# EAGLE design LED STRIP (EAGLE 6.0)
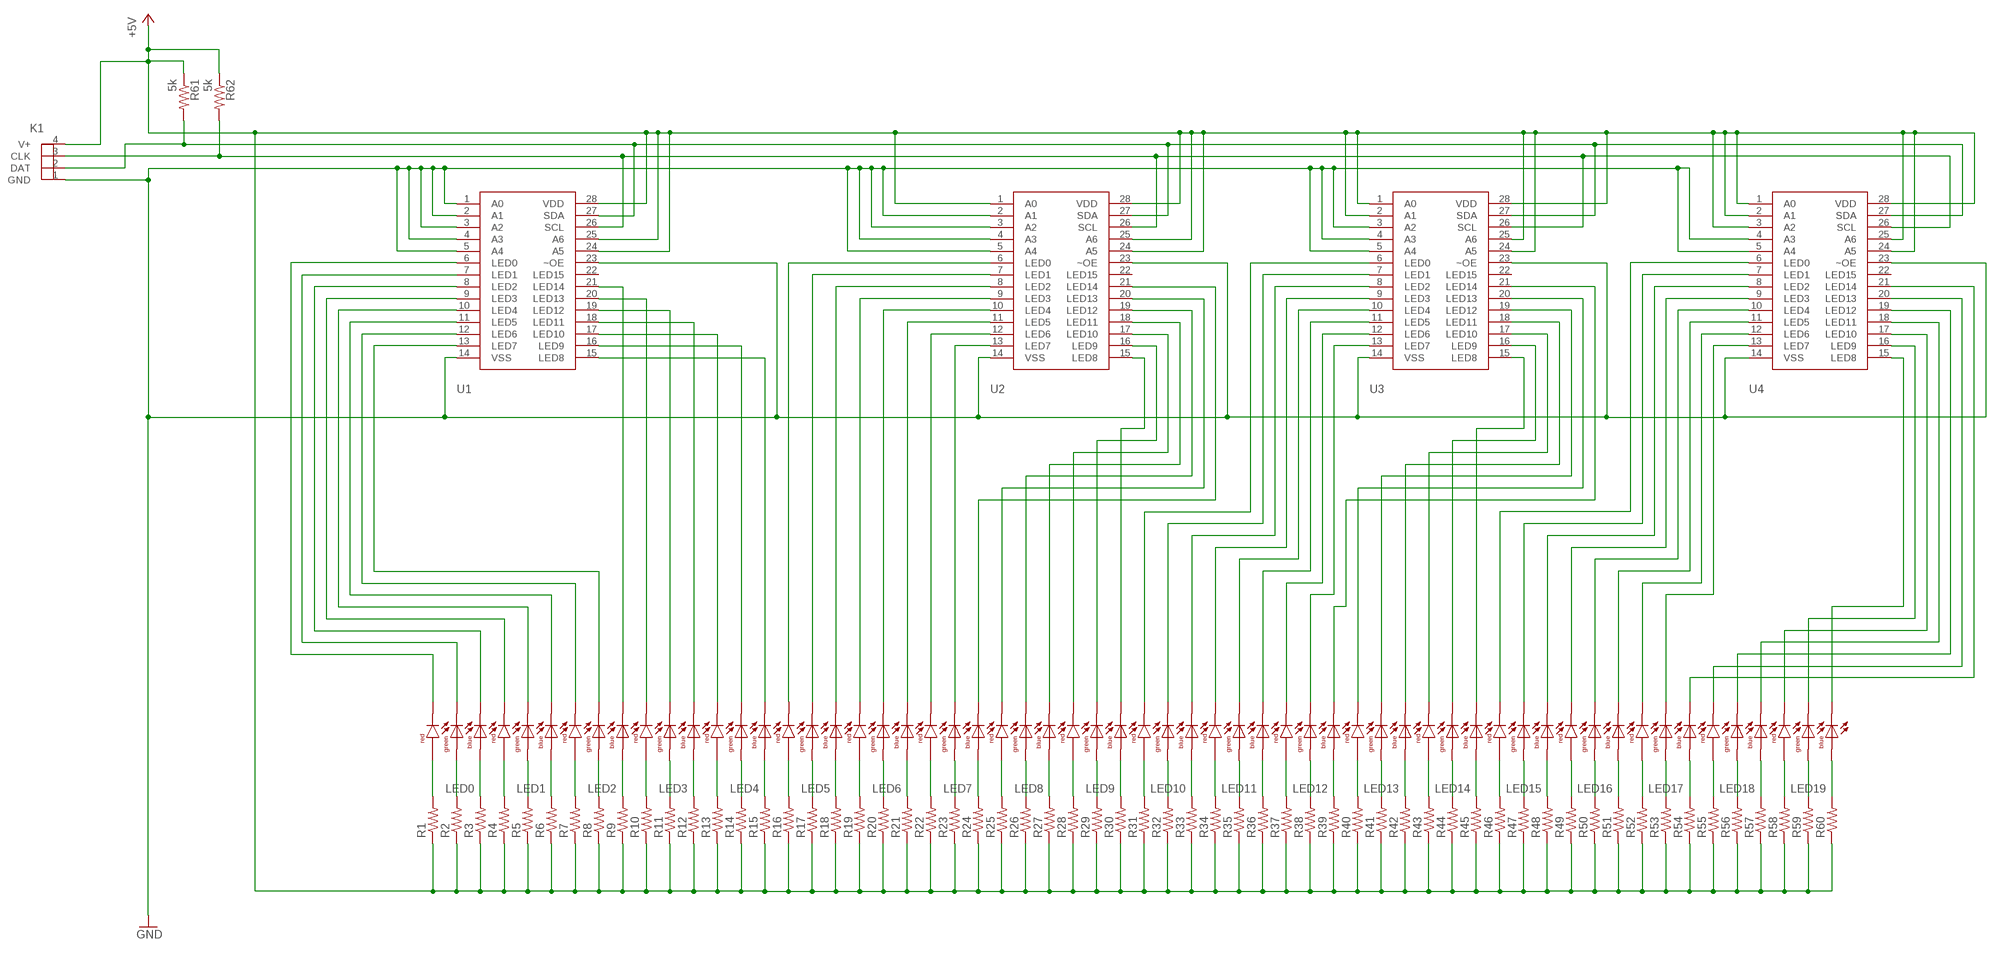
[diagram p0: schematic, sheet 1]

## Parts
K1  LEDCONN  [4CONN]
LED0  LED_RGB  [6-PLCC]
LED1  LED_RGB  [6-PLCC]
LED2  LED_RGB  [6-PLCC]
LED3  LED_RGB  [6-PLCC]
LED4  LED_RGB  [6-PLCC]
LED5  LED_RGB  [6-PLCC]
LED6  LED_RGB  [6-PLCC]
LED7  LED_RGB  [6-PLCC]
LED8  LED_RGB  [6-PLCC]
LED9  LED_RGB  [6-PLCC]
LED10  LED_RGB  [6-PLCC]
LED11  LED_RGB  [6-PLCC]
LED12  LED_RGB  [6-PLCC]
LED13  LED_RGB  [6-PLCC]
LED14  LED_RGB  [6-PLCC]
LED15  LED_RGB  [6-PLCC]
LED16  LED_RGB  [6-PLCC]
LED17  LED_RGB  [6-PLCC]
LED18  LED_RGB  [6-PLCC]
LED19  LED_RGB  [6-PLCC]
R1  R0402  [0402]
R2  R0402  [0402]
R3  R0402  [0402]
R4  R0402  [0402]
R5  R0402  [0402]
R6  R0402  [0402]
R7  R0402  [0402]
R8  R0402  [0402]
R9  R0402  [0402]
R10  R0402  [0402]
R11  R0402  [0402]
R12  R0402  [0402]
R13  R0402  [0402]
R14  R0402  [0402]
R15  R0402  [0402]
R16  R0402  [0402]
R17  R0402  [0402]
R18  R0402  [0402]
R19  R0402  [0402]
R20  R0402  [0402]
R21  R0402  [0402]
R22  R0402  [0402]
R23  R0402  [0402]
R24  R0402  [0402]
R25  R0402  [0402]
R26  R0402  [0402]
R27  R0402  [0402]
R28  R0402  [0402]
R29  R0402  [0402]
R30  R0402  [0402]
R31  R0402  [0402]
R32  R0402  [0402]
R33  R0402  [0402]
R34  R0402  [0402]
R35  R0402  [0402]
R36  R0402  [0402]
R37  R0402  [0402]
R38  R0402  [0402]
R39  R0402  [0402]
R40  R0402  [0402]
R41  R0402  [0402]
R42  R0402  [0402]
R43  R0402  [0402]
R44  R0402  [0402]
R45  R0402  [0402]
R46  R0402  [0402]
R47  R0402  [0402]
R48  R0402  [0402]
R49  R0402  [0402]
R50  R0402  [0402]
R51  R0402  [0402]
R52  R0402  [0402]
R53  R0402  [0402]
R54  R0402  [0402]
R55  R0402  [0402]
R56  R0402  [0402]
R57  R0402  [0402]
R58  R0402  [0402]
R59  R0402  [0402]
R60  R0402  [0402]
R61  5k  R0402  [0402]
R62  5k  R0402  [0402]
U1  PCA9635  [TSSOP28]
U2  PCA9635  [TSSOP28]
U3  PCA9635  [TSSOP28]
U4  PCA9635  [TSSOP28]

## Nets
+5V: K1.4(V+) R1.P$1 R2.P$1 R3.P$1 R4.P$1 R5.P$1 R6.P$1 R7.P$1 R8.P$1 R9.P$1 R10.P$1 R11.P$1 R12.P$1 R13.P$1 R14.P$1 R15.P$1 R16.P$1 R17.P$1 R18.P$1 R19.P$1 R20.P$1 R21.P$1 R22.P$1 R23.P$1 R24.P$1 R25.P$1 R26.P$1 R27.P$1 R28.P$1 R29.P$1 R30.P$1 R31.P$1 R32.P$1 R33.P$1 R34.P$1 R35.P$1 R36.P$1 R37.P$1 R38.P$1 R39.P$1 R40.P$1 R41.P$1 R42.P$1 R43.P$1 R44.P$1 R45.P$1 R46.P$1 R47.P$1 R48.P$1 R49.P$1 R50.P$1 R51.P$1 R52.P$1 R53.P$1 R54.P$1 R55.P$1 R56.P$1 R57.P$1 R58.P$1 R59.P$1 R60.P$1 R61.P$1 R62.P$1 U1.24(A5) U1.25(A6) U1.28(VDD) U2.1(A0) U2.24(A5) U2.25(A6) U2.28(VDD) U3.1(A0) U3.2(A1) U3.24(A5) U3.25(A6) U3.28(VDD) U4.1(A0) U4.2(A1) U4.3(A2) U4.24(A5) U4.25(A6) U4.28(VDD)
BLUE0: LED0.BLUE_LOW U1.8(LED2)
BLUE1: LED1.BLUE_LOW U1.11(LED5)
BLUE2: LED2.BLUE_LOW U1.21(LED14)
BLUE3: LED3.BLUE_LOW U1.18(LED11)
BLUE4: LED4.BLUE_LOW U1.15(LED8)
BLUE5: LED5.BLUE_LOW U2.8(LED2)
BLUE6: LED6.BLUE_LOW U2.11(LED5)
BLUE7: LED7.BLUE_LOW U2.21(LED14)
BLUE8: LED8.BLUE_LOW U2.18(LED11)
BLUE9: LED9.BLUE_LOW U2.15(LED8)
BLUE10: LED10.BLUE_LOW U3.8(LED2)
BLUE11: LED11.BLUE_LOW U3.11(LED5)
BLUE12: LED12.BLUE_LOW U3.21(LED14)
BLUE13: LED13.BLUE_LOW U3.18(LED11)
BLUE14: LED14.BLUE_LOW U3.15(LED8)
BLUE15: LED15.BLUE_LOW U4.8(LED2)
BLUE16: LED16.BLUE_LOW U4.11(LED5)
BLUE17: LED17.BLUE_LOW U4.21(LED14)
BLUE18: LED18.BLUE_LOW U4.18(LED11)
BLUE19: LED19.BLUE_LOW U4.15(LED8)
GND: K1.1(GND) U1.1(A0) U1.2(A1) U1.3(A2) U1.4(A3) U1.5(A4) U1.14(VSS) U1.23(~OE) U2.2(A1) U2.3(A2) U2.4(A3) U2.5(A4) U2.14(VSS) U2.23(~OE) U3.3(A2) U3.4(A3) U3.5(A4) U3.14(VSS) U3.23(~OE) U4.4(A3) U4.5(A4) U4.14(VSS) U4.23(~OE)
GREEN0: LED0.GREEN_LOW U1.7(LED1)
GREEN1: LED1.GREEN_LOW U1.10(LED4)
GREEN2: LED2.GREEN_LOW U1.13(LED7)
GREEN3: LED3.GREEN_LOW U1.19(LED12)
GREEN4: LED4.GREEN_LOW U1.16(LED9)
GREEN5: LED5.GREEN_LOW U2.7(LED1)
GREEN6: LED6.GREEN_LOW U2.10(LED4)
GREEN7: LED7.GREEN_LOW U2.13(LED7)
GREEN8: LED8.GREEN_LOW U2.19(LED12)
GREEN9: LED9.GREEN_LOW U2.16(LED9)
GREEN10: LED10.GREEN_LOW U3.7(LED1)
GREEN11: LED11.GREEN_LOW U3.10(LED4)
GREEN12: LED12.GREEN_LOW U3.13(LED7)
GREEN13: LED13.GREEN_LOW U3.19(LED12)
GREEN14: LED14.GREEN_LOW U3.16(LED9)
GREEN15: LED15.GREEN_LOW U4.7(LED1)
GREEN16: LED16.GREEN_LOW U4.10(LED4)
GREEN17: LED17.GREEN_LOW U4.13(LED7)
GREEN18: LED18.GREEN_LOW U4.19(LED12)
GREEN19: LED19.GREEN_LOW U4.16(LED9)
N$3: LED15.BLUE_HIGH R48.P$2
N$4: LED0.GREEN_HIGH R2.P$2
N$5: LED15.RED_HIGH R46.P$2
N$6: LED14.BLUE_HIGH R45.P$2
N$7: LED1.GREEN_HIGH R5.P$2
N$8: LED14.RED_HIGH R43.P$2
N$9: LED13.BLUE_HIGH R42.P$2
N$10: LED2.GREEN_HIGH R8.P$2
N$11: LED13.RED_HIGH R40.P$2
N$12: LED12.BLUE_HIGH R39.P$2
N$13: LED3.GREEN_HIGH R11.P$2
N$14: LED10.RED_HIGH R31.P$2
N$15: LED9.BLUE_HIGH R30.P$2
N$16: LED4.GREEN_HIGH R14.P$2
N$17: LED9.RED_HIGH R28.P$2
N$18: LED8.BLUE_HIGH R27.P$2
N$19: LED5.GREEN_HIGH R17.P$2
N$20: LED7.BLUE_HIGH R24.P$2
N$21: LED8.RED_HIGH R25.P$2
N$22: LED6.GREEN_HIGH R20.P$2
N$23: LED7.RED_HIGH R22.P$2
N$24: LED6.BLUE_HIGH R21.P$2
N$25: LED7.GREEN_HIGH R23.P$2
N$26: LED6.RED_HIGH R19.P$2
N$27: LED5.RED_HIGH R16.P$2
N$28: LED8.GREEN_HIGH R26.P$2
N$29: LED4.BLUE_HIGH R15.P$2
N$30: LED4.RED_HIGH R13.P$2
N$31: LED9.GREEN_HIGH R29.P$2
N$32: LED3.BLUE_HIGH R12.P$2
N$33: LED3.RED_HIGH R10.P$2
N$34: LED10.GREEN_HIGH R32.P$2
N$35: LED2.BLUE_HIGH R9.P$2
N$36: LED1.BLUE_HIGH R6.P$2
N$37: LED11.GREEN_HIGH R35.P$2
N$38: LED1.RED_HIGH R4.P$2
N$39: LED0.BLUE_HIGH R3.P$2
N$40: LED12.GREEN_HIGH R38.P$2
N$41: LED0.RED_HIGH R1.P$2
N$42: LED2.RED_HIGH R7.P$2
N$43: LED13.GREEN_HIGH R41.P$2
N$44: LED5.BLUE_HIGH R18.P$2
N$45: LED10.BLUE_HIGH R33.P$2
N$46: LED14.GREEN_HIGH R44.P$2
N$47: LED11.RED_HIGH R34.P$2
N$48: LED11.BLUE_HIGH R36.P$2
N$49: LED15.GREEN_HIGH R47.P$2
N$50: LED12.RED_HIGH R37.P$2
N$59: LED19.BLUE_HIGH R60.P$2
N$60: LED19.GREEN_HIGH R59.P$2
N$61: LED19.RED_HIGH R58.P$2
N$62: LED18.BLUE_HIGH R57.P$2
N$63: LED18.GREEN_HIGH R56.P$2
N$64: LED18.RED_HIGH R55.P$2
N$65: LED17.BLUE_HIGH R54.P$2
N$66: LED17.GREEN_HIGH R53.P$2
N$67: LED17.RED_HIGH R52.P$2
N$68: LED16.BLUE_HIGH R51.P$2
N$69: LED16.GREEN_HIGH R50.P$2
N$70: LED16.RED_HIGH R49.P$2
RED0: LED0.RED_LOW U1.6(LED0)
RED1: LED1.RED_LOW U1.9(LED3)
RED2: LED2.RED_LOW U1.12(LED6)
RED3: LED3.RED_LOW U1.20(LED13)
RED4: LED4.RED_LOW U1.17(LED10)
RED5: LED5.RED_LOW U2.6(LED0)
RED6: LED6.RED_LOW U2.9(LED3)
RED7: LED7.RED_LOW U2.12(LED6)
RED8: LED8.RED_LOW U2.20(LED13)
RED9: LED9.RED_LOW U2.17(LED10)
RED10: LED10.RED_LOW U3.6(LED0)
RED11: LED11.RED_LOW U3.9(LED3)
RED12: LED12.RED_LOW U3.12(LED6)
RED13: LED13.RED_LOW U3.20(LED13)
RED14: LED14.RED_LOW U3.17(LED10)
RED15: LED15.RED_LOW U4.6(LED0)
RED16: LED16.RED_LOW U4.9(LED3)
RED17: LED17.RED_LOW U4.12(LED6)
RED18: LED18.RED_LOW U4.20(LED13)
RED19: LED19.RED_LOW U4.17(LED10)
SCL: K1.3(CLK) R62.P$2 U1.26(SCL) U2.26(SCL) U3.26(SCL) U4.26(SCL)
SDA: K1.2(DAT) R61.P$2 U1.27(SDA) U2.27(SDA) U3.27(SDA) U4.27(SDA)
Unconnected: U1.22(LED15) U2.22(LED15) U3.22(LED15) U4.22(LED15)

## Library data of the parts
K1 = lightsuits:LEDCONN
LED0 LED1-LED19 = lightsuits:LED_RGB
R1-R62 = lightsuits:R0402
U1-U4 = lightsuits:PCA9635: The PCA9635 is an I2C-bus controlled 16-bit LED driver optimized for Red/Green/Blue/Amber (RGBA) color mixing applications. Each LED output has its own 8-bit resolution (256 steps) ﬁxed frequency individual PWM controller that operates at 97 kHz with a duty cycle that is adjustable from 0 % to 99.6 % to allow the LED to be set to a speciﬁc brightness value. An additional 8-bit resolution (256 steps) group PWM controller has both a ﬁxed frequency of 190 Hz and an adjustable frequency between 24 Hz to once every 10.73 seconds with a duty cycle that is adjustable from 0 % to 99.6% that is used to either dim or blink all LEDs with the same value.

## Board
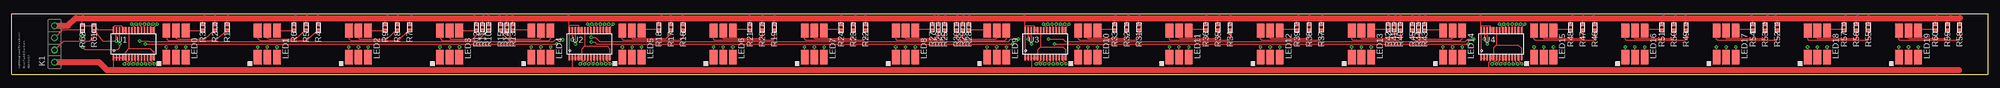
[diagram p1: board, top side]
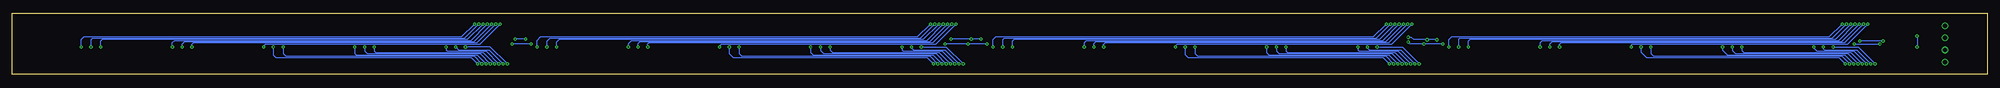
[diagram p2: board, bottom side, seen from below]

Size 412.75 x 12.7 mm. Coordinates in mm from the lower left corner, seen from the top.
Outline: 0,0 412.75,0 412.75,12.7 0,12.7 0,0
Copper layers (1*16): Top 0.035mm / dielectric 1.5mm / Bottom 0.035mm
Design rules: minimum track width 5mil, minimum drill 10mil, track to track 5mil, track to pad 5mil, pad to pad 5mil, via to via 5mil, smd to smd 5mil, copper to edge 5mil, drill to drill 5mil, minimum pad ring 10mil, minimum via ring 8mil, stop-mask expansion 4mil, vias tented up to drill 0mil, thermal gap 10mil

### Footprints (pad centres in the part's own frame; a part is rotated, then mirrored left to right if it is on the bottom)
4CONN = drill 0.89: 1 -3.81,0; 2 -1.27,0; 3 1.27,0; 4 3.81,0
6-PLCC = smd 3 x 1.6: BLUE_HIGH 2.8,-2; BLUE_LOW -2.8,-2; GREEN_HIGH 2.8,0; GREEN_LOW -2.8,0; RED_HIGH 2.8,2; RED_LOW -2.8,2
0402 = smd 0.4 x 0.6: P$1 0,0; P$2 0.9,0
TSSOP28 = smd 0.35 x 1.2: 1 -4.225,-2.9; 2 -3.575,-2.9; 3 -2.925,-2.9; 4 -2.275,-2.9; 5 -1.625,-2.9; 6 -0.975,-2.9; 7 -0.325,-2.9; 8 0.325,-2.9; 9 0.975,-2.9; 10 1.625,-2.9; 11 2.275,-2.9; 12 2.925,-2.9; 13 3.575,-2.9; 14 4.225,-2.9; 15 4.225,2.9; 16 3.575,2.9; 17 2.925,2.9; 18 2.275,2.9; 19 1.625,2.9; 20 0.975,2.9; 21 0.325,2.9; 22 -0.325,2.9; 23 -0.975,2.9; 24 -1.625,2.9; 25 -2.275,2.9; 26 -2.925,2.9; 27 -3.575,2.9; 28 -4.225,2.9

### Placement (x,y rotation side)
K1  8.89,6.35 90 top
LED0  34.29,6.35 90 top
LED1  53.34,6.35 90 top
LED2  72.39,6.35 90 top
LED3  91.44,6.35 90 top
LED4  110.49,6.35 90 top
LED5  129.54,6.35 90 top
LED6  148.59,6.35 90 top
LED7  167.64,6.35 90 top
LED8  186.69,6.35 90 top
LED9  205.74,6.35 90 top
LED10  224.79,6.35 90 top
LED11  243.84,6.35 90 top
LED12  262.89,6.35 90 top
LED13  281.94,6.35 90 top
LED14  300.99,6.35 90 top
LED15  320.04,6.35 90 top
LED16  339.09,6.35 90 top
LED17  358.14,6.35 90 top
LED18  377.19,6.35 90 top
LED19  396.24,6.35 90 top
R1  44.96,10.29 270 top
R2  42.42,10.29 270 top
R3  39.88,10.29 270 top
R4  64.01,10.29 270 top
R5  61.47,10.29 270 top
R6  58.93,10.29 270 top
R7  83.06,10.29 270 top
R8  80.52,10.29 270 top
R9  77.98,10.29 270 top
R10  99.57,10.29 270 top
R11  98.3,10.29 270 top
R12  97.03,10.29 270 top
R13  104.65,10.29 270 top
R14  103.38,10.29 270 top
R15  102.11,10.29 270 top
R16  140.21,10.29 270 top
R17  137.67,10.29 270 top
R18  135.13,10.29 270 top
R19  159.26,10.29 270 top
R20  156.72,10.29 270 top
R21  154.18,10.29 270 top
R22  178.31,10.29 270 top
R23  175.77,10.29 270 top
R24  173.23,10.29 270 top
R25  194.82,10.29 270 top
R26  193.55,10.29 270 top
R27  192.28,10.29 270 top
R28  199.9,10.29 270 top
R29  198.63,10.29 270 top
R30  197.36,10.29 270 top
R31  235.46,10.29 270 top
R32  232.92,10.29 270 top
R33  230.38,10.29 270 top
R34  254.51,10.29 270 top
R35  251.97,10.29 270 top
R36  249.43,10.29 270 top
R37  273.56,10.29 270 top
R38  271.02,10.29 270 top
R39  268.48,10.29 270 top
R40  290.07,10.29 270 top
R41  288.8,10.29 270 top
R42  287.53,10.29 270 top
R43  295.15,10.29 270 top
R44  293.88,10.29 270 top
R45  292.61,10.29 270 top
R46  330.71,10.29 270 top
R47  328.17,10.29 270 top
R48  325.63,10.29 270 top
R49  349.76,10.29 270 top
R50  347.22,10.29 270 top
R51  344.68,10.29 270 top
R52  368.81,10.29 270 top
R53  366.27,10.29 270 top
R54  363.73,10.29 270 top
R55  387.86,10.29 270 top
R56  385.32,10.29 270 top
R57  382.78,10.29 270 top
R58  406.91,10.29 270 top
R59  404.37,10.29 270 top
R60  401.83,10.29 270 top
R61  17.14,10.16 270 top
R62  14.73,10.16 270 top
U1  25.4,6.35 0 top
U2  120.65,6.35 0 top
U3  215.9,6.35 0 top
U4  311.15,6.35 0 top

### Tracks (layer width: path | path; a pad name or v marks a point on that pad's centre or on a via)
+5V
  Top 0.127: U1.24 U1.25 23.11,9.26 23.11,9.91 22.86,10.16 21.46,10.16 21.18,9.87 U1.28 18.05,9.25 R61.P$1 R62.P$1 14.73,11.68 14.86,11.81 | 116.42,10.13 U2.28 U2.1 | 116.42,10.13 116.59,10.29 118.24,10.29 118.36,10.16 118.36,9.26 U2.25 U2.24 | R3.P$1 39.88,11.43 40.26,11.81 | R2.P$1 42.42,11.81 | R1.P$1 44.96,11.68 45.09,11.81 | R6.P$1 58.93,11.56 59.18,11.81 | R5.P$1 61.47,11.68 61.59,11.81 | R4.P$1 64.01,11.68 63.88,11.81 | R9.P$1 77.98,11.3 78.49,11.81 | R8.P$1 80.52,11.68 80.64,11.81 | R7.P$1 83.06,11.43 83.44,11.81 | R12.P$1 97.03,11.43 96.65,11.81 | R11.P$1 98.3,11.56 98.55,11.81 | R10.P$1 99.57,11.81 | R15.P$1 102.11,11.68 101.98,11.81 | R14.P$1 103.38,11.81 | R13.P$1 104.65,11.81 | R18.P$1 135.13,11.3 135.64,11.81 | R17.P$1 137.67,11.81 | R16.P$1 140.21,11.81 | R21.P$1 154.18,11.81 | R20.P$1 156.72,11.68 156.84,11.81 | R19.P$1 159.26,11.68 159.38,11.81 | R24.P$1 173.23,11.81 | R23.P$1 175.77,11.43 176.15,11.81 | R22.P$1 178.31,11.81 | R27.P$1 192.28,11.43 192.66,11.81 | R26.P$1 193.55,11.68 193.68,11.81 | R25.P$1 194.82,11.68 194.94,11.81 | R30.P$1 197.36,11.68 197.49,11.81 | R29.P$1 198.63,11.68 198.75,11.81 | R28.P$1 199.9,11.56 200.15,11.81 | R33.P$1 230.38,11.56 230.63,11.81 | R32.P$1 232.92,11.56 233.17,11.81 | R31.P$1 235.46,11.68 235.59,11.81 | R36.P$1 249.43,11.68 249.56,11.81 | R35.P$1 251.97,11.43 252.35,11.81 | R34.P$1 254.51,11.81 | R39.P$1 268.48,11.43 268.86,11.81 | R38.P$1 271.02,11.68 271.14,11.81 | R37.P$1 273.56,11.68 273.69,11.81 | R42.P$1 287.53,11.68 287.65,11.81 | R41.P$1 288.8,11.56 289.05,11.81 | R40.P$1 290.07,11.81 | R45.P$1 292.61,11.81 | R44.P$1 293.88,11.68 294,11.81 | R43.P$1 295.15,11.68 295.27,11.81
  Top 0.127: R48.P$1 325.63,11.43 326.01,11.81 | R47.P$1 328.17,11.68 328.3,11.81 | R46.P$1 330.71,11.56 330.45,11.81 | R51.P$1 344.68,11.43 345.06,11.81 | R50.P$1 347.22,11.43 347.6,11.81 | R49.P$1 349.76,11.68 349.63,11.81 | R54.P$1 363.73,11.56 363.47,11.81 | R53.P$1 366.27,11.3 366.78,11.81 | R52.P$1 368.81,11.43 368.43,11.81 | R58.P$1 406.91,11.68 407.04,11.81 | R59.P$1 404.37,11.18 405,11.81 | R60.P$1 401.83,11.43 402.21,11.81 | R55.P$1 387.86,11.81 | R56.P$1 385.32,11.56 385.57,11.81 | R57.P$1 382.78,11.56 383.03,11.81 | 116.42,10.13 116.42,11.72 116.33,11.81 | 211.68,10 U3.28 U3.1 U3.2 | 211.68,10 211.84,10.16 213.49,10.16 213.62,10.02 U3.25 213.61,9.26 214.26,9.26 U3.24 | 211.68,10 211.68,11.72 211.58,11.81 | 306.93,10 U4.28 U4.1 U4.2 U4.3 | 306.93,10 307.09,10.16 308.74,10.16 308.88,10.02 U4.25 U4.24 | 306.93,10 306.93,11.72 306.83,11.81
  Top 1.27: K1.4 11.68,10.16 13.34,11.81 14.86,11.81 40.26,11.81 42.42,11.81 45.09,11.81 59.18,11.81 61.59,11.81 63.88,11.81 78.49,11.81 80.64,11.81 83.44,11.81 96.65,11.81 98.55,11.81 99.57,11.81 101.98,11.81 103.38,11.81 104.65,11.81 116.33,11.81 135.64,11.81 137.67,11.81 140.21,11.81 154.18,11.81 156.84,11.81 159.38,11.81 173.23,11.81 176.15,11.81 178.31,11.81 192.66,11.81 193.68,11.81 194.94,11.81 197.49,11.81 198.75,11.81 200.15,11.81 211.58,11.81 230.63,11.81 233.17,11.81 235.59,11.81 249.56,11.81 252.35,11.81 254.51,11.81 268.86,11.81 271.14,11.81 273.69,11.81 287.65,11.81 289.05,11.81 290.07,11.81 292.61,11.81 294,11.81 295.27,11.81 306.83,11.81 326.01,11.81 328.3,11.81 330.45,11.81 345.06,11.81 347.6,11.81 349.63,11.81 363.47,11.81 366.78,11.81 368.43,11.81 383.03,11.81 385.57,11.81 387.86,11.81 402.21,11.81 405,11.81 407.04,11.81
BLUE0  (via drill 0.25)
  Top 0.127: U1.8 25.73,2.61 v25.27,2.16 | LED0.BLUE_LOW 36.29,5.68 v36.32,5.71
  Bottom 0.127: v36.32,5.71 36.32,5.46 35.69,4.83 27.94,4.83 v25.27,2.16
BLUE1  (via drill 0.25)
  Top 0.127: U1.11 27.68,2.42 v27.94,2.16 | LED1.BLUE_LOW 55.34,5.68 v55.37,5.71
  Bottom 0.127: v55.37,5.71 55.37,5.08 54.36,4.06 29.84,4.06 v27.94,2.16
BLUE2  (via drill 0.25)
  Top 0.127: U1.21 25.73,9.83 v25.02,10.54 | LED2.BLUE_LOW 74.39,5.68 v74.42,5.71
  Bottom 0.127: v74.42,5.71 74.42,6.1 74.17,6.35 29.21,6.35 v25.02,10.54
BLUE3  (via drill 0.25)
  Top 0.127: U1.18 27.68,10.53 v27.69,10.54 | LED3.BLUE_LOW 93.44,5.68 v93.47,5.71
  Bottom 0.127: v93.47,5.71 93.47,6.6 92.96,7.11 31.11,7.11 v27.69,10.54
BLUE4  (via drill 0.25)
  Top 0.127: U1.15 29.62,9.81 v30.35,10.54 | LED4.BLUE_LOW 112.49,5.68 v112.52,5.71
  Bottom 0.127: v112.52,5.71 112.52,7.24 111.89,7.87 33.02,7.87 v30.35,10.54
BLUE5  (via drill 0.25)
  Top 0.127: U2.8 120.97,2.61 v120.52,2.16 | LED5.BLUE_LOW 131.54,5.68 v131.57,5.71
  Bottom 0.127: v131.57,5.71 131.57,5.08 131.32,4.83 123.19,4.83 v120.52,2.16
BLUE6  (via drill 0.25)
  Top 0.127: U2.11 122.92,2.42 v123.19,2.16 | LED6.BLUE_LOW 150.59,5.68 v150.62,5.71
  Bottom 0.127: v150.62,5.71 150.62,4.57 150.11,4.06 125.09,4.06 v123.19,2.16
BLUE7  (via drill 0.25)
  Top 0.127: U2.21 120.97,9.83 v120.27,10.54 | LED7.BLUE_LOW 169.64,5.68 v169.67,5.71
  Bottom 0.127: v169.67,5.71 169.67,5.97 169.29,6.35 124.46,6.35 v120.27,10.54
BLUE8  (via drill 0.25)
  Top 0.127: U2.18 122.92,10.53 v122.94,10.54 | LED8.BLUE_LOW 188.69,5.68 v188.72,5.71
  Bottom 0.127: v188.72,5.71 188.72,6.6 188.21,7.11 126.36,7.11 v122.94,10.54
BLUE9  (via drill 0.25)
  Top 0.127: U2.15 124.88,9.81 v125.6,10.54 | LED9.BLUE_LOW 207.74,5.68 v207.77,5.71
  Bottom 0.127: v207.77,5.71 207.77,7.24 207.14,7.87 128.27,7.87 v125.6,10.54
BLUE10  (via drill 0.25)
  Top 0.127: U3.8 216.22,2.61 v215.77,2.16 | LED10.BLUE_LOW 226.79,5.68 v226.82,5.71
  Bottom 0.127: v226.82,5.71 226.82,5.08 226.57,4.83 218.44,4.83 v215.77,2.16
BLUE11  (via drill 0.25)
  Top 0.127: U3.11 218.18,2.42 v218.44,2.16 | LED11.BLUE_LOW 245.84,5.68 v245.87,5.71
  Bottom 0.127: v245.87,5.71 245.87,4.57 245.36,4.06 220.34,4.06 v218.44,2.16
BLUE12  (via drill 0.25)
  Top 0.127: U3.21 216.22,9.83 v215.52,10.54 | LED12.BLUE_LOW 264.89,5.68 v264.92,5.71
  Bottom 0.127: v264.92,5.71 264.92,5.97 264.54,6.35 219.71,6.35 v215.52,10.54
BLUE13  (via drill 0.25)
  Top 0.127: U3.18 218.18,10.53 v218.19,10.54 | LED13.BLUE_LOW 283.94,5.68 v283.97,5.71
  Bottom 0.127: v283.97,5.71 283.97,6.48 283.34,7.11 221.62,7.11 v218.19,10.54
BLUE14  (via drill 0.25)
  Top 0.127: U3.15 220.12,9.81 v220.85,10.54 | LED14.BLUE_LOW 302.99,5.68 v303.02,5.71
  Bottom 0.127: v303.02,5.71 303.02,7.11 302.26,7.87 223.52,7.87 v220.85,10.54
BLUE15  (via drill 0.25)
  Top 0.127: U4.8 311.48,2.61 v311.02,2.16 | LED15.BLUE_LOW 322.04,5.68 v322.07,5.71
  Bottom 0.127: v322.07,5.71 322.07,5.08 321.82,4.83 313.69,4.83 v311.02,2.16
BLUE16  (via drill 0.25)
  Top 0.127: U4.11 313.43,2.42 v313.69,2.16 | LED16.BLUE_LOW 341.09,5.68 v341.12,5.71
  Bottom 0.127: v341.12,5.71 341.12,4.32 340.87,4.06 315.6,4.06 v313.69,2.16
BLUE17  (via drill 0.25)
  Top 0.127: U4.21 311.48,9.83 v310.77,10.54 | v360.17,5.71 360.17,3.58 LED17.BLUE_LOW
  Bottom 0.127: v360.17,5.71 360.17,5.97 359.79,6.35 314.96,6.35 v310.77,10.54
BLUE18  (via drill 0.25)
  Top 0.127: U4.18 313.43,10.53 v313.44,10.54 | v379.22,5.71 379.22,3.58 LED18.BLUE_LOW
  Bottom 0.127: v379.22,5.71 379.22,6.6 378.71,7.11 316.87,7.11 v313.44,10.54
BLUE19  (via drill 0.25)
  Top 0.127: U4.15 315.38,9.81 v316.1,10.54 | v398.27,5.71 398.27,3.58 LED19.BLUE_LOW
  Bottom 0.127: v398.27,5.71 398.27,7.24 397.64,7.87 318.77,7.87 v316.1,10.54
GND
  Top 0.127: U1.23 24.43,5.38 | 24.43,5.38 23.75,4.7 23.77,4.67 U1.5 U1.4 U1.3 U1.2 U1.1 21.18,1.24 20.83,0.89 | U2.23 119.67,5.88 | 119.67,5.88 119,5.21 119,3.48 U2.5 U2.4 U2.3 U2.2 117.08,1.12 116.84,0.89 | U3.23 214.93,5.76 | 214.93,5.76 214.25,5.08 214.25,3.48 U3.5 U3.4 U3.3 212.97,0.89 212.98,0.89 | 308.48,0.89 308.48,2.41 308.88,2.8 U4.4 U4.5 309.5,3.48 309.5,5.46 310.18,6.14 | U4.23 310.18,6.14 | 24.43,5.38 28.91,5.38 29.59,4.7 29.59,3.48 U1.14 | 119.67,5.88 124.29,5.88 124.84,5.33 124.84,3.48 U2.14 | 214.93,5.76 219.54,5.76 220.09,5.21 220.09,3.48 U3.14 | 310.18,6.14 314.67,6.14 315.34,5.46 315.34,3.48 U4.14
  Top 1.27: K1.1 18.16,2.54 19.81,0.89 20.83,0.89 116.84,0.89 212.98,0.89 308.48,0.89 406.78,0.89
GREEN0  (via drill 0.25)
  Top 0.127: U1.7 25.07,2.85 v24.38,2.16 | LED0.GREEN_LOW v34.29,5.71
  Bottom 0.127: v34.29,5.71 34.29,5.33 34.04,5.08 27.3,5.08 v24.38,2.16
GREEN1  (via drill 0.25)
  Top 0.127: U1.10 27.02,2.18 v27.05,2.16 | LED1.GREEN_LOW v53.34,5.71
  Bottom 0.127: v53.34,5.71 53.34,4.95 52.7,4.32 29.21,4.32 v27.05,2.16
GREEN2  (via drill 0.25)
  Top 0.127: U1.13 28.98,2.9 v29.72,2.16 | LED2.GREEN_LOW v72.39,5.71
  Bottom 0.127: v72.39,5.71 72.39,4.7 71.25,3.56 31.11,3.56 v29.72,2.16
GREEN3  (via drill 0.25)
  Top 0.127: U1.19 27.02,10.31 v26.8,10.54 | LED3.GREEN_LOW v91.44,5.71
  Bottom 0.127: v91.44,5.71 91.44,6.35 90.93,6.86 30.48,6.86 v26.8,10.54
GREEN4  (via drill 0.25)
  Top 0.127: U1.16 28.98,10.05 v29.46,10.54 | LED4.GREEN_LOW v110.49,5.71
  Bottom 0.127: v110.49,5.71 110.49,7.37 110.24,7.62 32.38,7.62 v29.46,10.54
GREEN5  (via drill 0.25)
  Top 0.127: U2.7 120.33,2.85 v119.63,2.16 | LED5.GREEN_LOW v129.54,5.71
  Bottom 0.127: v129.54,5.71 129.54,5.46 129.16,5.08 122.56,5.08 v119.63,2.16
GREEN6  (via drill 0.25)
  Top 0.127: U2.10 122.28,2.18 v122.3,2.16 | LED6.GREEN_LOW v148.59,5.71
  Bottom 0.127: v148.59,5.71 148.59,4.83 148.08,4.32 124.46,4.32 v122.3,2.16
GREEN7  (via drill 0.25)
  Top 0.127: U2.13 124.22,2.9 v124.97,2.16 | LED7.GREEN_LOW v167.64,5.71
  Bottom 0.127: v167.64,5.71 167.64,4.19 167,3.56 126.36,3.56 v124.97,2.16
GREEN8  (via drill 0.25)
  Top 0.127: U2.19 122.28,10.31 v122.05,10.54 | LED8.GREEN_LOW v186.69,5.71
  Bottom 0.127: v186.69,5.71 186.69,6.48 186.31,6.86 125.73,6.86 v122.05,10.54
GREEN9  (via drill 0.25)
  Top 0.127: 124.21,9.25 U2.16 124.22,10.05 v124.71,10.54 | LED9.GREEN_LOW v205.74,5.71
  Bottom 0.127: v205.74,5.71 205.74,7.24 205.36,7.62 127.64,7.62 v124.71,10.54
GREEN10  (via drill 0.25)
  Top 0.127: U3.7 215.57,2.85 v214.88,2.16 | LED10.GREEN_LOW v224.79,5.71
  Bottom 0.127: v224.79,5.71 224.79,5.46 224.41,5.08 217.81,5.08 v214.88,2.16
GREEN11  (via drill 0.25)
  Top 0.127: U3.10 217.53,2.18 v217.55,2.16 | LED11.GREEN_LOW v243.84,5.71
  Bottom 0.127: v243.84,5.71 243.84,4.95 243.21,4.32 219.71,4.32 v217.55,2.16
GREEN12  (via drill 0.25)
  Top 0.127: U3.13 219.47,2.9 v220.22,2.16 | LED12.GREEN_LOW v262.89,5.71
  Bottom 0.127: v262.89,5.71 262.89,4.32 262.13,3.56 221.62,3.56 v220.22,2.16
GREEN13  (via drill 0.25)
  Top 0.127: U3.19 217.53,10.31 v217.3,10.54 | LED13.GREEN_LOW v281.94,5.71
  Bottom 0.127: v281.94,5.71 281.94,6.48 281.56,6.86 220.98,6.86 v217.3,10.54
GREEN14  (via drill 0.25)
  Top 0.127: U3.16 219.47,10.05 v219.96,10.54 | LED14.GREEN_LOW v300.99,5.71
  Bottom 0.127: v300.99,5.71 300.99,6.98 300.36,7.62 222.88,7.62 v219.96,10.54
GREEN15  (via drill 0.25)
  Top 0.127: U4.7 310.82,2.85 v310.13,2.16 | LED15.GREEN_LOW v320.04,5.71
  Bottom 0.127: v320.04,5.71 319.4,5.08 313.06,5.08 v310.13,2.16
GREEN16  (via drill 0.25)
  Top 0.127: U4.10 312.77,2.18 v312.8,2.16 | LED16.GREEN_LOW v339.09,5.71
  Bottom 0.127: v339.09,5.71 339.09,4.83 338.58,4.32 314.96,4.32 v312.8,2.16
GREEN17  (via drill 0.25)
  Top 0.127: U4.13 314.73,2.9 v315.47,2.16 | LED17.GREEN_LOW v358.14,5.71
  Bottom 0.127: v358.14,5.71 358.14,4.06 357.63,3.56 316.87,3.56 v315.47,2.16
GREEN18  (via drill 0.25)
  Top 0.127: U4.19 312.77,10.31 v312.55,10.54 | v377.19,5.71 LED18.GREEN_LOW
  Bottom 0.127: v377.19,5.71 377.19,6.35 376.68,6.86 316.23,6.86 v312.55,10.54
GREEN19  (via drill 0.25)
  Top 0.127: U4.16 314.73,10.05 v315.21,10.54 | v396.24,5.71 LED19.GREEN_LOW
  Bottom 0.127: v396.24,5.71 396.24,7.24 395.86,7.62 318.13,7.62 v315.21,10.54
N$3
  Top 0.127: R48.P$2 322.28,9.39 LED15.BLUE_HIGH
N$4
  Top 0.127: LED0.GREEN_HIGH 34.29,7.62 34.67,7.37 40.27,7.37 R2.P$2
N$5
  Top 0.127: R46.P$2 330.71,7.24 330.58,7.11 318.26,7.11 318.01,7.37 318.01,9.12 LED15.RED_HIGH
N$6
  Top 0.127: R45.P$2 292.61,7.75 293.24,7.11 302.64,7.11 303.02,7.49 303.02,9.12 LED14.BLUE_HIGH
N$7
  Top 0.127: LED1.GREEN_HIGH 53.34,7.62 53.72,7.37 59.32,7.37 R5.P$2
N$8
  Top 0.127: R43.P$2 298.75,9.39 LED14.RED_HIGH
N$9
  Top 0.127: R42.P$2 284.18,9.39 LED13.BLUE_HIGH
N$10
  Top 0.127: LED2.GREEN_HIGH 72.39,7.49 72.52,7.37 78.24,7.37 R8.P$2
N$11
  Top 0.127: R40.P$2 290.07,7.37 289.81,7.11 280.16,7.11 279.91,7.37 279.91,9.12 LED13.RED_HIGH
N$12
  Top 0.127: R39.P$2 265.13,9.39 LED12.BLUE_HIGH
N$13
  Top 0.127: LED3.GREEN_HIGH 91.44,7.62 91.69,7.37 96.28,7.37 R11.P$2
N$14
  Top 0.127: R31.P$2 235.46,7.62 234.95,7.11 223.14,7.11 222.76,7.49 222.76,9.12 LED10.RED_HIGH
N$15
  Top 0.127: R30.P$2 197.36,7.49 197.74,7.11 207.52,7.11 207.77,7.37 207.77,9.12 LED9.BLUE_HIGH
N$16
  Top 0.127: R14.P$2 103.38,8.64 104.65,7.37 110.36,7.37 110.49,7.49 LED4.GREEN_HIGH
N$17
  Top 0.127: R28.P$2 203.5,9.39 LED9.RED_HIGH
N$18
  Top 0.127: R27.P$2 188.93,9.39 LED8.BLUE_HIGH
N$19
  Top 0.127: R17.P$2 137.67,8.51 136.53,7.37 129.67,7.37 129.54,7.49 LED5.GREEN_HIGH
N$20
  Top 0.127: R24.P$2 169.88,9.39 LED7.BLUE_HIGH
N$21
  Top 0.127: R25.P$2 194.82,7.24 194.69,7.11 184.91,7.11 184.66,7.37 184.66,9.12 LED8.RED_HIGH
N$22
  Top 0.127: R20.P$2 156.72,7.75 156.34,7.37 148.72,7.37 148.59,7.49 LED6.GREEN_HIGH
N$23
  Top 0.127: R22.P$2 178.31,7.49 177.93,7.11 165.86,7.11 165.61,7.37 165.61,9.12 LED7.RED_HIGH
N$24
  Top 0.127: R21.P$2 150.83,9.39 LED6.BLUE_HIGH
N$25
  Top 0.127: R23.P$2 175.77,7.75 175.39,7.37 167.77,7.37 167.64,7.49 LED7.GREEN_HIGH
N$26
  Top 0.127: R19.P$2 159.26,7.37 159,7.11 146.81,7.11 146.56,7.37 146.56,9.12 LED6.RED_HIGH
N$27
  Top 0.127: R16.P$2 140.21,7.75 139.57,7.11 127.76,7.11 127.51,7.37 127.51,9.12 LED5.RED_HIGH
N$28
  Top 0.127: R26.P$2 193.55,7.62 193.29,7.37 186.82,7.37 186.69,7.49 LED8.GREEN_HIGH
N$29
  Top 0.127: R15.P$2 102.11,8.89 103.89,7.11 112.27,7.11 112.52,7.37 112.52,9.12 LED4.BLUE_HIGH
N$30
  Top 0.127: R13.P$2 108.25,9.39 LED4.RED_HIGH
N$31
  Top 0.127: R29.P$2 198.63,7.49 198.75,7.37 205.61,7.37 205.74,7.49 LED9.GREEN_HIGH
N$32
  Top 0.127: LED3.BLUE_HIGH 96.79,9.15 R12.P$2
N$33
  Top 0.127: LED3.RED_HIGH 89.44,7.59 89.92,7.11 97.29,7.11 R10.P$2
N$34
  Top 0.127: R32.P$2 232.92,7.75 232.54,7.37 224.92,7.37 224.79,7.49 LED10.GREEN_HIGH
N$35
  Top 0.127: LED2.BLUE_HIGH 77.74,9.15 R9.P$2
N$36
  Top 0.127: LED1.BLUE_HIGH 58.69,9.15 R6.P$2
N$37
  Top 0.127: R35.P$2 251.97,7.62 251.71,7.37 244.09,7.37 243.84,7.62 LED11.GREEN_HIGH
N$38
  Top 0.127: LED1.RED_HIGH 51.34,7.46 51.82,7.11 61.61,7.11 R4.P$2
N$39
  Top 0.127: LED0.BLUE_HIGH 39.64,9.15 R3.P$2
N$40
  Top 0.127: R38.P$2 271.02,7.87 270.51,7.37 263.02,7.37 262.89,7.49 LED12.GREEN_HIGH
N$41
  Top 0.127: LED0.RED_HIGH 32.29,7.33 32.64,7.11 42.56,7.11 R1.P$2
N$42
  Top 0.127: LED2.RED_HIGH 70.39,7.46 70.87,7.11 80.66,7.11 R7.P$2
N$43
  Top 0.127: R41.P$2 288.8,7.75 288.42,7.37 282.07,7.37 281.94,7.49 LED13.GREEN_HIGH
N$44
  Top 0.127: R18.P$2 131.78,9.39 LED5.BLUE_HIGH
N$45
  Top 0.127: R33.P$2 227.03,9.39 LED10.BLUE_HIGH
N$46
  Top 0.127: R44.P$2 293.88,7.87 294.39,7.37 300.74,7.37 300.99,7.62 LED14.GREEN_HIGH
N$47
  Top 0.127: R34.P$2 254.51,7.24 254.38,7.11 242.06,7.11 241.81,7.37 241.81,9.12 LED11.RED_HIGH
N$48
  Top 0.127: R36.P$2 246.08,9.39 LED11.BLUE_HIGH
N$49
  Top 0.127: R47.P$2 328.17,7.62 327.91,7.37 320.17,7.37 320.04,7.49 LED15.GREEN_HIGH
N$50
  Top 0.127: R37.P$2 273.56,7.49 273.18,7.11 261.11,7.11 260.86,7.37 260.86,9.12 LED12.RED_HIGH
N$59
  Top 0.127: R60.P$2 398.48,9.39 LED19.BLUE_HIGH
N$60
  Top 0.127: R59.P$2 404.37,7.87 403.86,7.37 396.37,7.37 396.24,7.49 LED19.GREEN_HIGH
N$61
  Top 0.127: R58.P$2 406.91,7.62 406.4,7.11 394.46,7.11 394.21,7.37 394.21,9.12 LED19.RED_HIGH
N$62
  Top 0.127: R57.P$2 379.43,9.39 LED18.BLUE_HIGH
N$63
  Top 0.127: R56.P$2 385.32,7.49 385.19,7.37 377.32,7.37 377.19,7.49 LED18.GREEN_HIGH
N$64
  Top 0.127: R55.P$2 387.86,7.49 387.48,7.11 375.41,7.11 375.16,7.37 375.16,9.12 LED18.RED_HIGH
N$65
  Top 0.127: R54.P$2 360.38,9.39 LED17.BLUE_HIGH
N$66
  Top 0.127: R53.P$2 366.27,7.75 365.89,7.37 358.27,7.37 358.14,7.49 LED17.GREEN_HIGH
N$67
  Top 0.127: R52.P$2 368.81,7.37 368.55,7.11 356.36,7.11 356.11,7.37 356.11,9.12 LED17.RED_HIGH
N$68
  Top 0.127: R51.P$2 341.33,9.39 LED16.BLUE_HIGH
N$69
  Top 0.127: R50.P$2 347.22,7.75 346.84,7.37 339.22,7.37 339.09,7.49 LED16.GREEN_HIGH
N$70
  Top 0.127: R49.P$2 349.76,7.37 349.5,7.11 337.31,7.11 337.06,7.37 337.06,9.12 LED16.RED_HIGH
RED0  (via drill 0.25)
  Top 0.127: v32.26,5.71 32.26,3.58 LED0.RED_LOW | v23.5,2.16 24,2.67 24.26,2.67 24.38,2.79 24.38,3.05 24.43,3.09 U1.6
  Bottom 0.127: v32.26,5.71 27.05,5.71 v23.5,2.16
RED1  (via drill 0.25)
  Top 0.127: U1.9 26.38,2.37 v26.16,2.16 | LED1.RED_LOW 51.34,5.68 v51.31,5.71
  Bottom 0.127: v51.31,5.71 51.31,4.95 50.93,4.57 28.57,4.57 v26.16,2.16
RED2  (via drill 0.25)
  Top 0.127: U1.12 28.32,2.66 v28.83,2.16 | LED2.RED_LOW 70.39,5.68 v70.36,5.71
  Bottom 0.127: v70.36,5.71 70.36,4.32 69.85,3.81 30.48,3.81 v28.83,2.16
RED3  (via drill 0.25)
  Top 0.127: U1.20 26.38,10.07 v25.91,10.54 | LED3.RED_LOW 89.44,5.68 v89.41,5.71
  Bottom 0.127: v89.41,5.71 89.41,6.22 89.03,6.6 29.84,6.6 v25.91,10.54
RED4  (via drill 0.25)
  Top 0.127: U1.17 28.32,10.29 v28.57,10.54 | LED4.RED_LOW 108.49,4.54 108.46,4.57 v108.46,5.71
  Bottom 0.127: v108.46,5.71 108.46,6.98 108.08,7.37 31.75,7.37 v28.57,10.54
RED5  (via drill 0.25)
  Top 0.127: U2.6 119.67,2.96 119.38,2.67 119.25,2.67 v118.75,2.16 | LED5.RED_LOW 127.54,5.68 v127.51,5.71
  Bottom 0.127: v127.51,5.71 122.3,5.71 v118.75,2.16
RED6  (via drill 0.25)
  Top 0.127: U2.9 121.62,2.37 v121.41,2.16 | LED6.RED_LOW 146.59,3.65 146.56,3.68 v146.56,5.71
  Bottom 0.127: v146.56,5.71 146.56,4.83 146.3,4.57 123.83,4.57 v121.41,2.16
RED7  (via drill 0.25)
  Top 0.127: U2.12 123.58,2.66 v124.08,2.16 | LED7.RED_LOW 165.64,5.68 v165.61,5.71
  Bottom 0.127: v165.61,5.71 165.61,4.32 165.1,3.81 125.73,3.81 v124.08,2.16
RED8  (via drill 0.25)
  Top 0.127: U2.20 121.62,10.07 v121.16,10.54 | LED8.RED_LOW 184.69,5.68 v184.66,5.71
  Bottom 0.127: v184.66,5.71 184.66,6.22 184.28,6.6 125.09,6.6 v121.16,10.54
RED9  (via drill 0.25)
  Top 0.127: U2.17 123.58,10.29 v123.83,10.54 | LED9.RED_LOW 203.74,5.68 v203.71,5.71
  Bottom 0.127: v203.71,5.71 203.71,6.98 203.33,7.37 127,7.37 v123.83,10.54
RED10  (via drill 0.25)
  Top 0.127: U3.6 214.88,3.41 214.88,2.79 214.76,2.67 214.63,2.67 214.12,2.16 v214,2.16 | LED10.RED_LOW 222.79,5.68 v222.76,5.71
  Bottom 0.127: v222.76,5.71 217.55,5.71 v214,2.16
RED11  (via drill 0.25)
  Top 0.127: U3.9 216.88,2.37 v216.66,2.16 | LED11.RED_LOW 241.84,5.68 v241.81,5.71
  Bottom 0.127: v241.81,5.71 241.81,5.08 241.3,4.57 219.07,4.57 v216.66,2.16
RED12  (via drill 0.25)
  Top 0.127: U3.12 218.82,2.66 v219.33,2.16 | LED12.RED_LOW 260.89,5.68 v260.86,5.71
  Bottom 0.127: v260.86,5.71 260.86,4.32 260.35,3.81 220.98,3.81 v219.33,2.16
RED13  (via drill 0.25)
  Top 0.127: U3.20 216.88,10.07 v216.41,10.54 | LED13.RED_LOW 279.94,5.68 v279.91,5.71
  Bottom 0.127: v279.91,5.71 279.91,6.35 279.65,6.6 220.34,6.6 v216.41,10.54
RED14  (via drill 0.25)
  Top 0.127: U3.17 218.82,10.29 v219.07,10.54 | LED14.RED_LOW 298.99,5.68 v298.96,5.71
  Bottom 0.127: v298.96,5.71 298.96,6.73 298.32,7.37 222.25,7.37 v219.07,10.54
RED15  (via drill 0.25)
  Top 0.127: U4.6 310.18,2.96 309.88,2.67 309.75,2.67 v309.25,2.16 | LED15.RED_LOW 318.04,5.68 v318.01,5.71
  Bottom 0.127: v309.25,2.16 312.8,5.71 v318.01,5.71
RED16  (via drill 0.25)
  Top 0.127: U4.9 312.12,2.37 v311.91,2.16 | LED16.RED_LOW 337.09,5.68 v337.06,5.71
  Bottom 0.127: v337.06,5.71 337.06,4.83 336.8,4.57 314.32,4.57 v311.91,2.16
RED17  (via drill 0.25)
  Top 0.127: U4.12 314.07,2.66 v314.58,2.16 | LED17.RED_LOW 356.14,5.68 v356.11,5.71
  Bottom 0.127: v356.11,5.71 356.11,4.32 355.6,3.81 316.23,3.81 v314.58,2.16
RED18  (via drill 0.25)
  Top 0.127: U4.20 312.12,10.07 v311.66,10.54 | v375.16,5.71 375.16,3.58 LED18.RED_LOW
  Bottom 0.127: v375.16,5.71 375.16,6.22 374.78,6.6 315.6,6.6 v311.66,10.54
RED19  (via drill 0.25)
  Top 0.127: U4.17 314.07,10.29 v314.32,10.54 | v394.21,5.71 394.21,3.58 LED19.RED_LOW
  Bottom 0.127: v394.21,5.71 394.21,6.98 393.83,7.37 317.5,7.37 v314.32,10.54
SCL  (via drill 0.25)
  Top 0.127: K1.3 10.53,9.26 R62.P$2 v14.73,8 | U1.26 22.48,6.48 v22.48,6.35 22.48,5.59 22.1,5.21 15.24,5.21 v14.73,5.71 | v27.81,6.35 v113.79,6.35 | v117.73,6.35 U2.26 | v212.98,6.35 U3.26 | v217.81,6.35 v304.29,6.35 | v308.23,6.35 U4.26 | v121.03,6.73 121.79,6.73 122.17,6.35 v209.04,6.35
  Bottom 0.127: v14.73,8 v14.73,5.71 | v27.81,6.35 v22.48,6.35 | v113.79,6.35 v117.73,6.35 120.65,6.35 v121.03,6.73 | v209.04,6.35 v212.98,6.35 v217.81,6.35 | v304.29,6.35 v308.23,6.35
SDA  (via drill 0.25)
  Top 0.127: U1.27 21.82,7.49 v21.84,6.98 18.91,6.98 R61.P$2 17.14,7.87 16.26,6.98 10.79,6.98 K1.2 | v26.67,6.98 28.57,6.98 28.7,6.86 113.16,6.86 113.54,7.24 v115.06,7.24 | v117.09,7.24 117.09,9.23 U2.27 | U4.27 307.57,7.64 307.59,7.62 v307.59,7.37 | v121.03,7.75 121.92,7.75 122.81,6.86 208.15,6.86 208.66,7.37 v210.31,7.37 | v212.34,7.37 212.34,9.23 U3.27 | v216.53,7.37 219.58,7.37 220.09,6.86 303.66,6.86 304.17,7.37 v305.44,7.37
  Bottom 0.127: v21.84,6.98 v26.67,6.98 | v115.06,7.24 v117.09,7.24 119.89,7.24 120.4,7.75 v121.03,7.75 | v210.31,7.37 v212.34,7.37 v216.53,7.37 | v305.44,7.37 v307.59,7.37

### Text on the board
tNames: Light Integrated Threads, LLC | Ryan Tuck & Dan Kern | REV A 2013